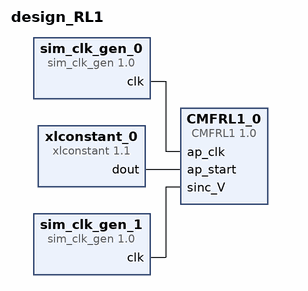
[diagram p0: block diagram of the top level]
# Vivado block design design_RL1, xc7z020clg484-1, Vivado 2018.3
create_bd_design design_RL1

create_bd_cell -type ip -vlnv xilinx.com:ip:sim_clk_gen:1.0 sim_clk_gen_0
create_bd_cell -type ip -vlnv xilinx.com:ip:sim_clk_gen:1.0 sim_clk_gen_1
set_property -dict {CONFIG.FREQ_HZ 1000000} [get_bd_cells sim_clk_gen_1]
create_bd_cell -type ip -vlnv xilinx.com:ip:xlconstant:1.1 xlconstant_0
create_bd_cell -type ip -vlnv xilinx.com:user:CMFRL1:1.0 CMFRL1_0

# ---- connections ----

connect_bd_net [get_bd_pins sim_clk_gen_0/clk] [get_bd_pins CMFRL1_0/ap_clk]
connect_bd_net [get_bd_pins xlconstant_0/dout] [get_bd_pins CMFRL1_0/ap_start]
connect_bd_net [get_bd_pins sim_clk_gen_1/clk] [get_bd_pins CMFRL1_0/sinc_V]

validate_bd_design
save_bd_design
